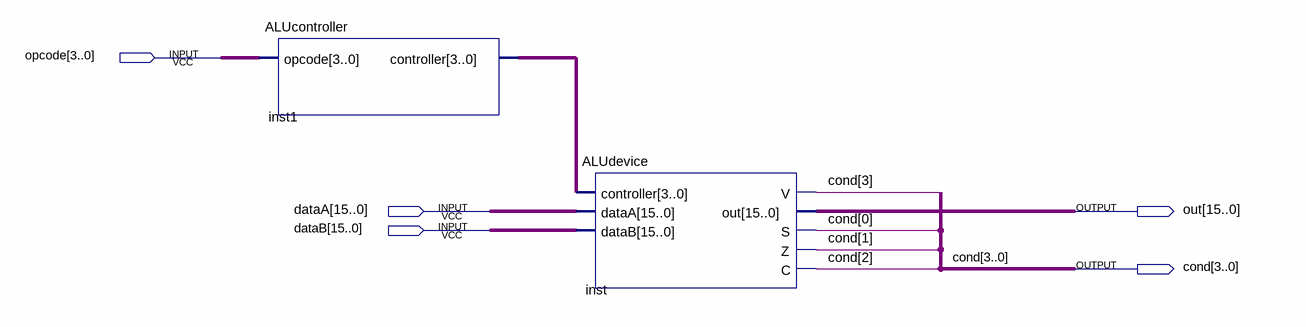
[diagram p0: schematic sheet]
// Quartus schematic ALU.bdf as structural Verilog: 2 symbols, 5 pins
module ALU (
  input  [3:0] opcode,
  input  [15:0] dataA,
  input  [15:0] dataB,
  output [15:0] out,
  output [3:0] cond
);

  wire [3:0] inst1_controller;

  ALUcontroller inst1 (.opcode(opcode), .controller(inst1_controller));
  ALUdevice inst (
    .controller(inst1_controller), .dataA(dataA), .dataB(dataB), .V(cond[3]), .out(out), .S(cond[0]),
    .Z(cond[1]), .C(cond[2]));
endmodule
